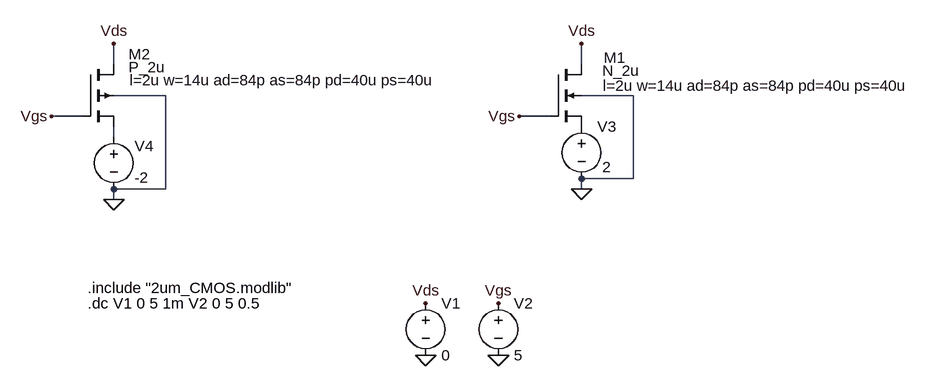
[diagram p0: schematic 1e_nMOS.asc]
1e_nMOS.asc, the LTspice schematic file:
Version 4
SHEET 1 1296 680
WIRE -64 112 -64 80
WIRE 656 112 656 80
WIRE 16 160 -64 160
WIRE 736 160 656 160
WIRE -112 192 -160 192
WIRE 608 192 560 192
WIRE -64 224 -64 208
WIRE 736 288 736 160
WIRE 736 288 656 288
WIRE 16 304 16 160
WIRE 16 304 -64 304
WIRE 656 304 656 288
WIRE -64 320 -64 304
FLAG -160 192 Vgs
FLAG -64 80 Vds
FLAG 656 80 Vds
FLAG 560 192 Vgs
FLAG 528 560 0
FLAG 416 560 0
FLAG 416 480 Vds
FLAG 528 480 Vgs
FLAG 656 304 0
FLAG -64 320 0
SYMBOL nmos4 608 112 R0
WINDOW 0 82 -10 Left 2
WINDOW 3 80 10 Left 2
WINDOW 123 81 33 Left 2
SYMATTR InstName M1
SYMATTR Value N_2u
SYMATTR Value2 l=2u w=14u ad=84p as=84p pd=40u ps=40u
SYMBOL pmos4 -112 112 R0
WINDOW 0 71 -16 Left 2
WINDOW 3 71 4 Left 2
WINDOW 123 72 24 Left 2
SYMATTR InstName M2
SYMATTR Value P_2u
SYMATTR Value2 l=2u w=14u ad=84p as=84p pd=40u ps=40u
SYMBOL voltage 416 464 R0
WINDOW 123 0 0 Left 0
WINDOW 39 0 0 Left 0
SYMATTR InstName V1
SYMATTR Value 0
SYMBOL voltage 528 464 R0
WINDOW 123 0 0 Left 0
WINDOW 39 0 0 Left 0
SYMATTR InstName V2
SYMATTR Value 5
SYMBOL voltage 656 192 R0
WINDOW 123 0 0 Left 0
WINDOW 39 0 0 Left 0
WINDOW 3 32 78 Left 2
SYMATTR Value 2
SYMATTR InstName V3
SYMBOL voltage -64 208 R0
WINDOW 123 0 0 Left 0
WINDOW 39 0 0 Left 0
WINDOW 0 32 30 Left 2
WINDOW 3 32 78 Left 2
SYMATTR InstName V4
SYMATTR Value -2
TEXT -104 456 Left 2 !.include "2um_CMOS.modlib"
TEXT -104 480 Left 2 !.dc V1 0 5 1m V2 0 5 0.5

The netlist it stands for:
* 1e_nMOS.asc
M1 Vds Vgs P001 0 N_2u l=2u w=14u ad=84p as=84p pd=40u ps=40u
M2 Vds Vgs N001 0 P_2u l=2u w=14u ad=84p as=84p pd=40u ps=40u
V1 Vds 0 0
V2 Vgs 0 5
V3 P001 0 2
V4 N001 0 -2
.model NMOS NMOS
.model PMOS PMOS
.lib standard.mos
.include "2um_CMOS.modlib"
.dc V1 0 5 1m V2 0 5 0.5
.backanno
.end